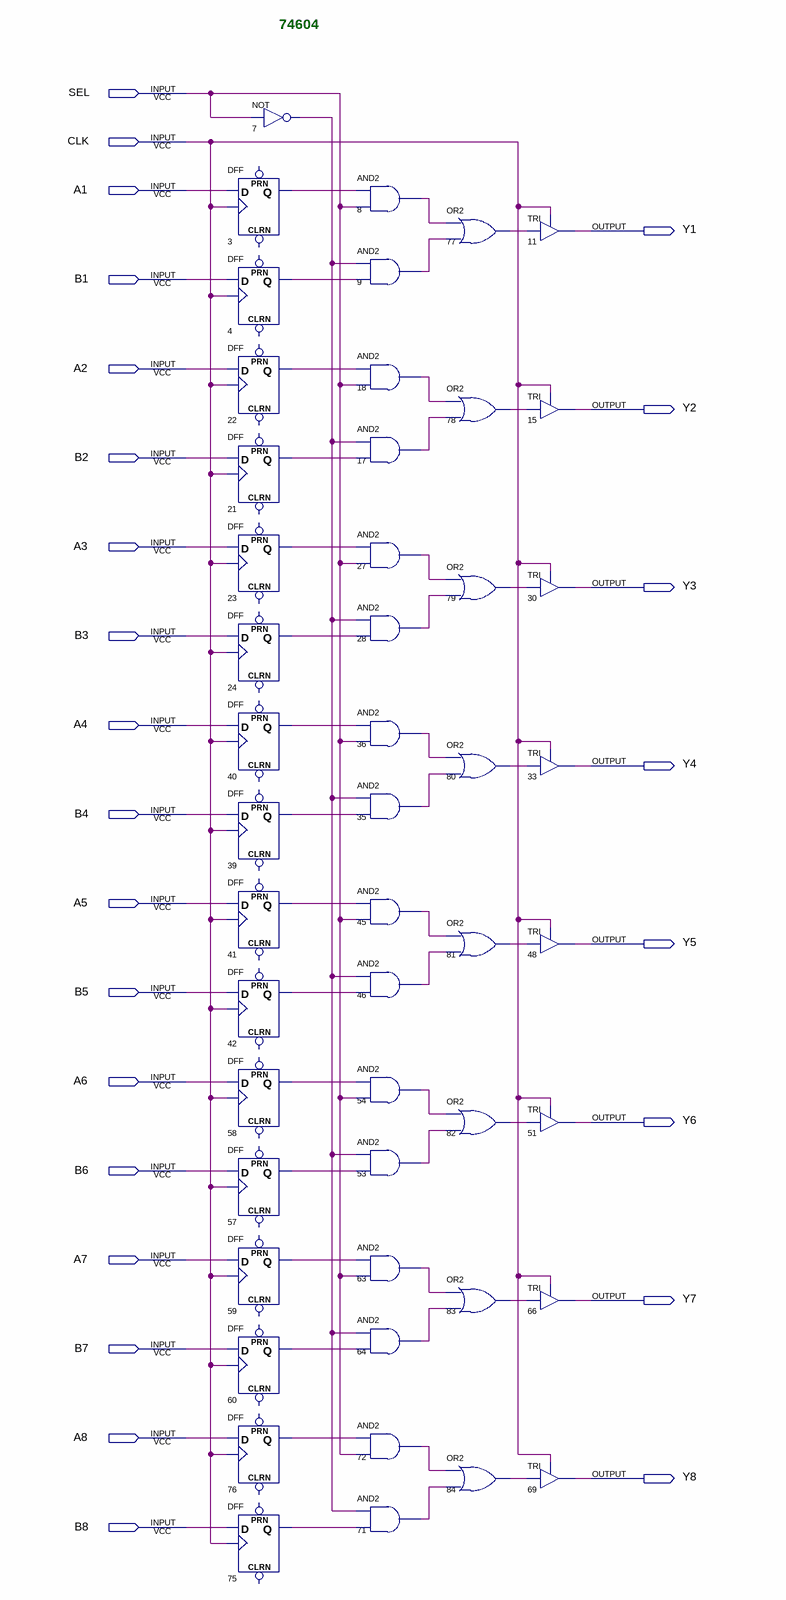
[diagram p0: schematic sheet]
// Quartus schematic 74604.bdf as structural Verilog: 49 symbols, 26 pins
module \74604  (
  input  SEL,
  input  CLK,
  input  A1,
  input  B1,
  input  A2,
  input  B2,
  input  A3,
  input  B3,
  input  A4,
  input  B4,
  input  A5,
  input  B5,
  input  A6,
  input  B6,
  input  A7,
  input  B7,
  input  A8,
  input  B8,
  output Y1,
  output Y2,
  output Y3,
  output Y4,
  output Y5,
  output Y6,
  output Y7,
  output Y8
);

  wire n3_q, n4_q, n7_out, n8_out, n9_out, n17_out, n18_out, n21_q, n22_q, n23_q, n24_q, n27_out, n28_out,
       n35_out, n36_out, n39_q, n40_q, n41_q, n42_q, n45_out, n46_out, n53_out, n54_out, n57_q, n58_q, n59_q,
       n60_q, n63_out, n64_out, n71_out, n72_out, n75_q, n76_q, n77_out, n78_out, n79_out, n80_out, n81_out,
       n82_out, n83_out, n84_out;

  DFF u_3 (.CLK(CLK), .D(A1), .Q(n3_q));  // open: CLRN, PRN
  DFF u_4 (.CLK(CLK), .D(B1), .Q(n4_q));  // open: CLRN, PRN
  DFF u_22 (.CLK(CLK), .D(A2), .Q(n22_q));  // open: CLRN, PRN
  DFF u_21 (.CLK(CLK), .D(B2), .Q(n21_q));  // open: CLRN, PRN
  DFF u_23 (.CLK(CLK), .D(A3), .Q(n23_q));  // open: CLRN, PRN
  DFF u_24 (.CLK(CLK), .D(B3), .Q(n24_q));  // open: CLRN, PRN
  DFF u_40 (.CLK(CLK), .D(A4), .Q(n40_q));  // open: CLRN, PRN
  DFF u_39 (.CLK(CLK), .D(B4), .Q(n39_q));  // open: CLRN, PRN
  DFF u_41 (.CLK(CLK), .D(A5), .Q(n41_q));  // open: CLRN, PRN
  DFF u_42 (.CLK(CLK), .D(B5), .Q(n42_q));  // open: CLRN, PRN
  DFF u_58 (.CLK(CLK), .D(A6), .Q(n58_q));  // open: CLRN, PRN
  DFF u_57 (.CLK(CLK), .D(B6), .Q(n57_q));  // open: CLRN, PRN
  DFF u_59 (.CLK(CLK), .D(A7), .Q(n59_q));  // open: CLRN, PRN
  DFF u_60 (.CLK(CLK), .D(B7), .Q(n60_q));  // open: CLRN, PRN
  DFF u_76 (.CLK(CLK), .D(A8), .Q(n76_q));  // open: CLRN, PRN
  DFF u_75 (.CLK(CLK), .D(B8), .Q(n75_q));  // open: CLRN, PRN
  not u_7 (n7_out, SEL);
  and u_8 (n8_out, n3_q, SEL);
  and u_9 (n9_out, n7_out, n4_q);
  and u_18 (n18_out, n22_q, SEL);
  and u_17 (n17_out, n7_out, n21_q);
  and u_27 (n27_out, n23_q, SEL);
  and u_28 (n28_out, n7_out, n24_q);
  and u_36 (n36_out, n40_q, SEL);
  and u_35 (n35_out, n7_out, n39_q);
  and u_45 (n45_out, n41_q, SEL);
  and u_46 (n46_out, n7_out, n42_q);
  and u_54 (n54_out, n58_q, SEL);
  and u_53 (n53_out, n7_out, n57_q);
  and u_63 (n63_out, n59_q, SEL);
  and u_64 (n64_out, n7_out, n60_q);
  and u_72 (n72_out, n76_q, SEL);
  and u_71 (n71_out, n7_out, n75_q);
  or u_77 (n77_out, n8_out, n9_out);
  or u_78 (n78_out, n18_out, n17_out);
  or u_79 (n79_out, n27_out, n28_out);
  or u_80 (n80_out, n36_out, n35_out);
  or u_81 (n81_out, n45_out, n46_out);
  or u_82 (n82_out, n54_out, n53_out);
  or u_83 (n83_out, n63_out, n64_out);
  or u_84 (n84_out, n72_out, n71_out);
  TRI u_11 (.IN(n77_out), .OE(CLK), .OUT(Y1));
  TRI u_15 (.IN(n78_out), .OE(CLK), .OUT(Y2));
  TRI u_30 (.IN(n79_out), .OE(CLK), .OUT(Y3));
  TRI u_33 (.IN(n80_out), .OE(CLK), .OUT(Y4));
  TRI u_48 (.IN(n81_out), .OE(CLK), .OUT(Y5));
  TRI u_51 (.IN(n82_out), .OE(CLK), .OUT(Y6));
  TRI u_66 (.IN(n83_out), .OE(CLK), .OUT(Y7));
  TRI u_69 (.IN(n84_out), .OE(CLK), .OUT(Y8));

  // Notes on the sheet:
  //   74604
endmodule
